# EAGLE design ConverterBoardRev2 (3) (EAGLE 8.4.0)
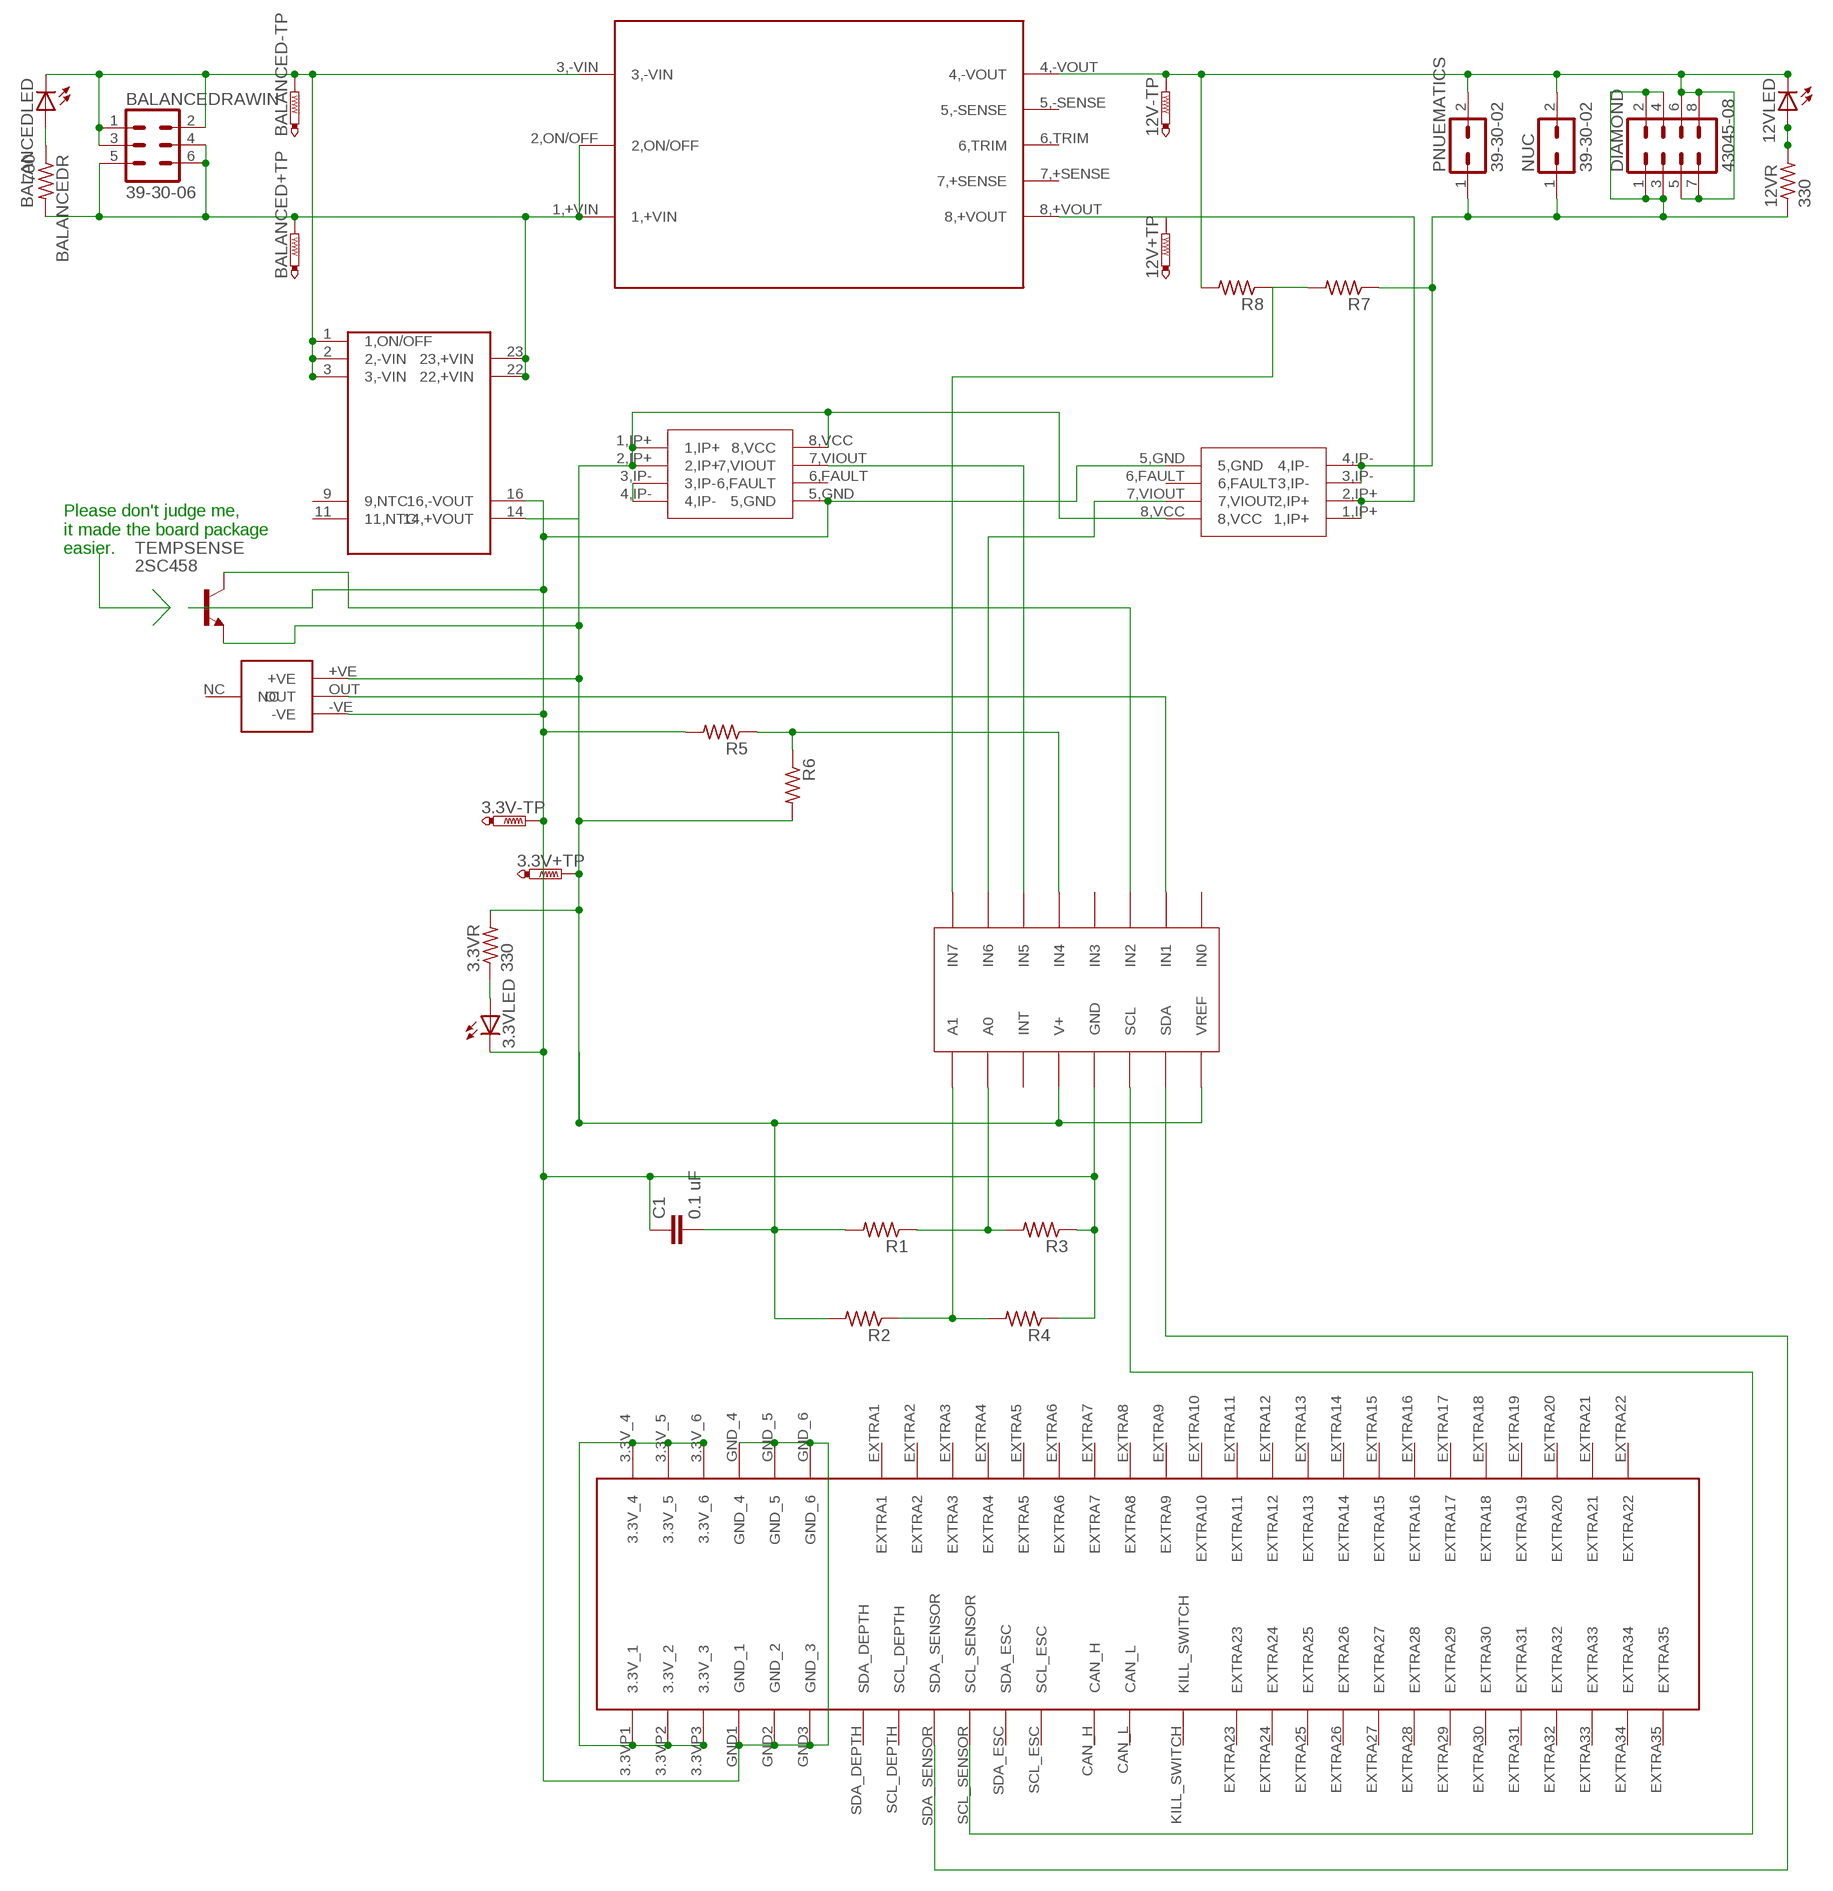
[diagram p0: schematic, sheet 1]

## Parts
3.3V+TP  PTR1B1,27  [B1,27]
3.3V-TP  PTR1B1,27  [B1,27]
3.3VLED  LTST-S270GKT  [LTST-S270GKT]
3.3VR  330  R-US_0204/7  [0204/7]
3V3CUR  CURRENTSENS  [CURRENTSENS]
12V+TP  PTR1B1,27  [B1,27]
12V-TP  PTR1B1,27  [B1,27]
12VCUR  CURRENTSENS  [CURRENTSENS]
12VLED  LTST-S270GKT  [LTST-S270GKT]
12VR  330  R-US_0204/7  [0204/7]
BALANCED+TP  PTR1B1,27  [B1,27]
BALANCED-TP  PTR1B1,27  [B1,27]
BALANCEDLED  LTST-S270GKT  [LTST-S270GKT]
BALANCEDR  700  R-US_0204/7  [0204/7]
BALANCEDRAWIN  39-30-06  [39-30-?06?]
C1  0.1 uF  C-EU025-024X044  [C025-024X044]
DIAMOND  43045-08  [43045-08]
NUC  39-30-02  [39-30-?02?]
PNUEMATICS  39-30-02  [39-30-?02?]
R1  R-US_0204/7  [0204/7]
R2  R-US_0204/7  [0204/7]
R3  R-US_0204/7  [0204/7]
R4  R-US_0204/7  [0204/7]
R5  R-US_0204/7  [0204/7]
R6  R-US_0204/7  [0204/7]
R7  R-US_0204/7  [0204/7]
R8  R-US_0204/7  [0204/7]
TEMPSENSE  2SC458  [TO92-ECB]
U$1  12VCONV  [12VCONV]
U$2  3.3VCONV  [3.3VCONV]
U$3  5530843  [5530843-6-BOARDFINGERS]
U$6  HUMIDITYSENSOR  [HUMIDITYSENSOR]
U$8  ADC128D818  [TSSOP-16]

## Nets
3.3IDATA: 3V3CUR.7,VIOUT U$8.IN5
3.3V+: 3.3V+TP.TP 3.3VR.2 3V3CUR.1,IP+ 3V3CUR.2,IP+ 3V3CUR.8,VCC 12VCUR.8,VCC C1.2 R1.2 R2.2 R6.2 TEMPSENSE.E U$2.14(14,+VOUT) U$6.+VE U$8.V+ U$8.VREF
3.3V-: 3.3V-TP.TP 3.3VLED.CATHODE(C) 3V3CUR.5,GND 12VCUR.5,GND C1.1 R3.1 R4.1 R5.2 TEMPSENSE.B U$2.16(16,-VOUT) U$3.GND1(GND_1) U$3.GND2(GND_2) U$3.GND3(GND_3) U$3.GND_4 U$3.GND_5 U$3.GND_6 U$6.-VE U$8.GND
3.3VBKPLN: 3V3CUR.3,IP- 3V3CUR.4,IP- U$3.3.3V_4 U$3.3.3V_5 U$3.3.3V_6 U$3.3.3VP1(3.3V_1) U$3.3.3VP2(3.3V_2) U$3.3.3VP3(3.3V_3)
3.3VDATA: R5.1 R6.1 U$8.IN4
3.3VLED: 3.3VLED.ANODE(A) 3.3VR.1
12IDATA: 12VCUR.7,VIOUT U$8.IN6
12VDATA: R7.2 R8.1 U$8.IN7
12VGND: 12V-TP.TP 12VLED.CATHODE(C) DIAMOND.5 DIAMOND.6 DIAMOND.7 DIAMOND.8 NUC.2 PNUEMATICS.2 R8.2 U$1.4,-VOUT
12VLED: 12VLED.ANODE(A) 12VR.2
12VMON: 12VCUR.3,IP- 12VCUR.4,IP- 12VR.1 DIAMOND.1 DIAMOND.2 DIAMOND.3 DIAMOND.4 NUC.1 PNUEMATICS.1 R7.1
12VUNMON: 12VCUR.1,IP+ 12VCUR.2,IP+ U$1.8,+VOUT
A0: R1.1 R3.2 U$8.A0
A1: R2.1 R4.2 U$8.A1
BALANCED+: BALANCED+TP.TP BALANCEDR.2 BALANCEDRAWIN.4 BALANCEDRAWIN.5 BALANCEDRAWIN.6 U$1.1,+VIN U$1.2,ON/OFF U$2.22(22,+VIN) U$2.23(23,+VIN)
BALANCED-: BALANCED-TP.TP BALANCEDLED.CATHODE(C) BALANCEDRAWIN.1 BALANCEDRAWIN.2 BALANCEDRAWIN.3 U$1.3,-VIN U$2.1(1,ON/OFF) U$2.2(2,-VIN) U$2.3(3,-VIN)
BALANCEDLED: BALANCEDLED.ANODE(A) BALANCEDR.1
HUMIDITYDATA: U$6.OUT U$8.IN1
SCL: U$3.SCL_SENSOR U$8.SCL
SDA: U$3.SDA_SENSOR U$8.SDA
TEMPDATA: TEMPSENSE.C U$8.IN2
Unconnected: 3V3CUR.6,FAULT 12V+TP.TP 12VCUR.6,FAULT U$1.5,-SENSE U$1.6,TRIM U$1.7,+SENSE U$2.9(9,NTC) U$2.11(11,NTC) U$3.CAN_H U$3.CAN_L U$3.EXTRA1 U$3.EXTRA2 U$3.EXTRA3 U$3.EXTRA4 U$3.EXTRA5 U$3.EXTRA6 U$3.EXTRA7 U$3.EXTRA8 U$3.EXTRA9 U$3.EXTRA10 U$3.EXTRA11 U$3.EXTRA12 U$3.EXTRA13 U$3.EXTRA14 U$3.EXTRA15 U$3.EXTRA16 U$3.EXTRA17 U$3.EXTRA18 U$3.EXTRA19 U$3.EXTRA20 U$3.EXTRA21 U$3.EXTRA22 U$3.EXTRA23 U$3.EXTRA24 U$3.EXTRA25 U$3.EXTRA26 U$3.EXTRA27 U$3.EXTRA28 U$3.EXTRA29 U$3.EXTRA30 U$3.EXTRA31 U$3.EXTRA32 U$3.EXTRA33 U$3.EXTRA34 U$3.EXTRA35 U$3.KILL_SWITCH U$3.SCL_DEPTH U$3.SCL_ESC U$3.SDA_DEPTH U$3.SDA_ESC U$6.NC U$8.IN0 U$8.IN3 U$8.INT

## Notes on the sheet
- Please don't judge me,
  it made the board package
  easier.

## Library data of the parts
3.3V+TP 3.3V-TP 12V+TP 12V-TP BALANCED+TP BALANCED-TP = testpad:PTR1: TEST PIN
3.3VLED 12VLED BALANCEDLED = LTST-S270GKT:LTST-S270GKT
3.3VR 12VR BALANCEDR R1-R8 = resistor:R-US_: RESISTOR, American symbol
3V3CUR 12VCUR = CurrentSensor:CURRENTSENS
BALANCEDRAWIN = con-molex-mini-fit:39-30-?06?: HEADER
C1 = resistor:C-EU: CAPACITOR, European symbol
DIAMOND = con-molex-micro-fit:43045-08: HEADER
NUC PNUEMATICS = con-molex-mini-fit:39-30-?02?: HEADER
TEMPSENSE = transistor:2SC458: NPN Silicon Epitaxial Planar Transistor Source: SEMTECH ELECTRONICS LTD. ... 2SC458 1.pdf
U$1 = 12VCONV:12VCONV
U$2 = 3.3V Converter:3.3VCONV
U$3 = 5530843-6:5530843
U$6 = HumiditySensor:HUMIDITYSENSOR
U$8 = ADC128D818:ADC128D818

## Board
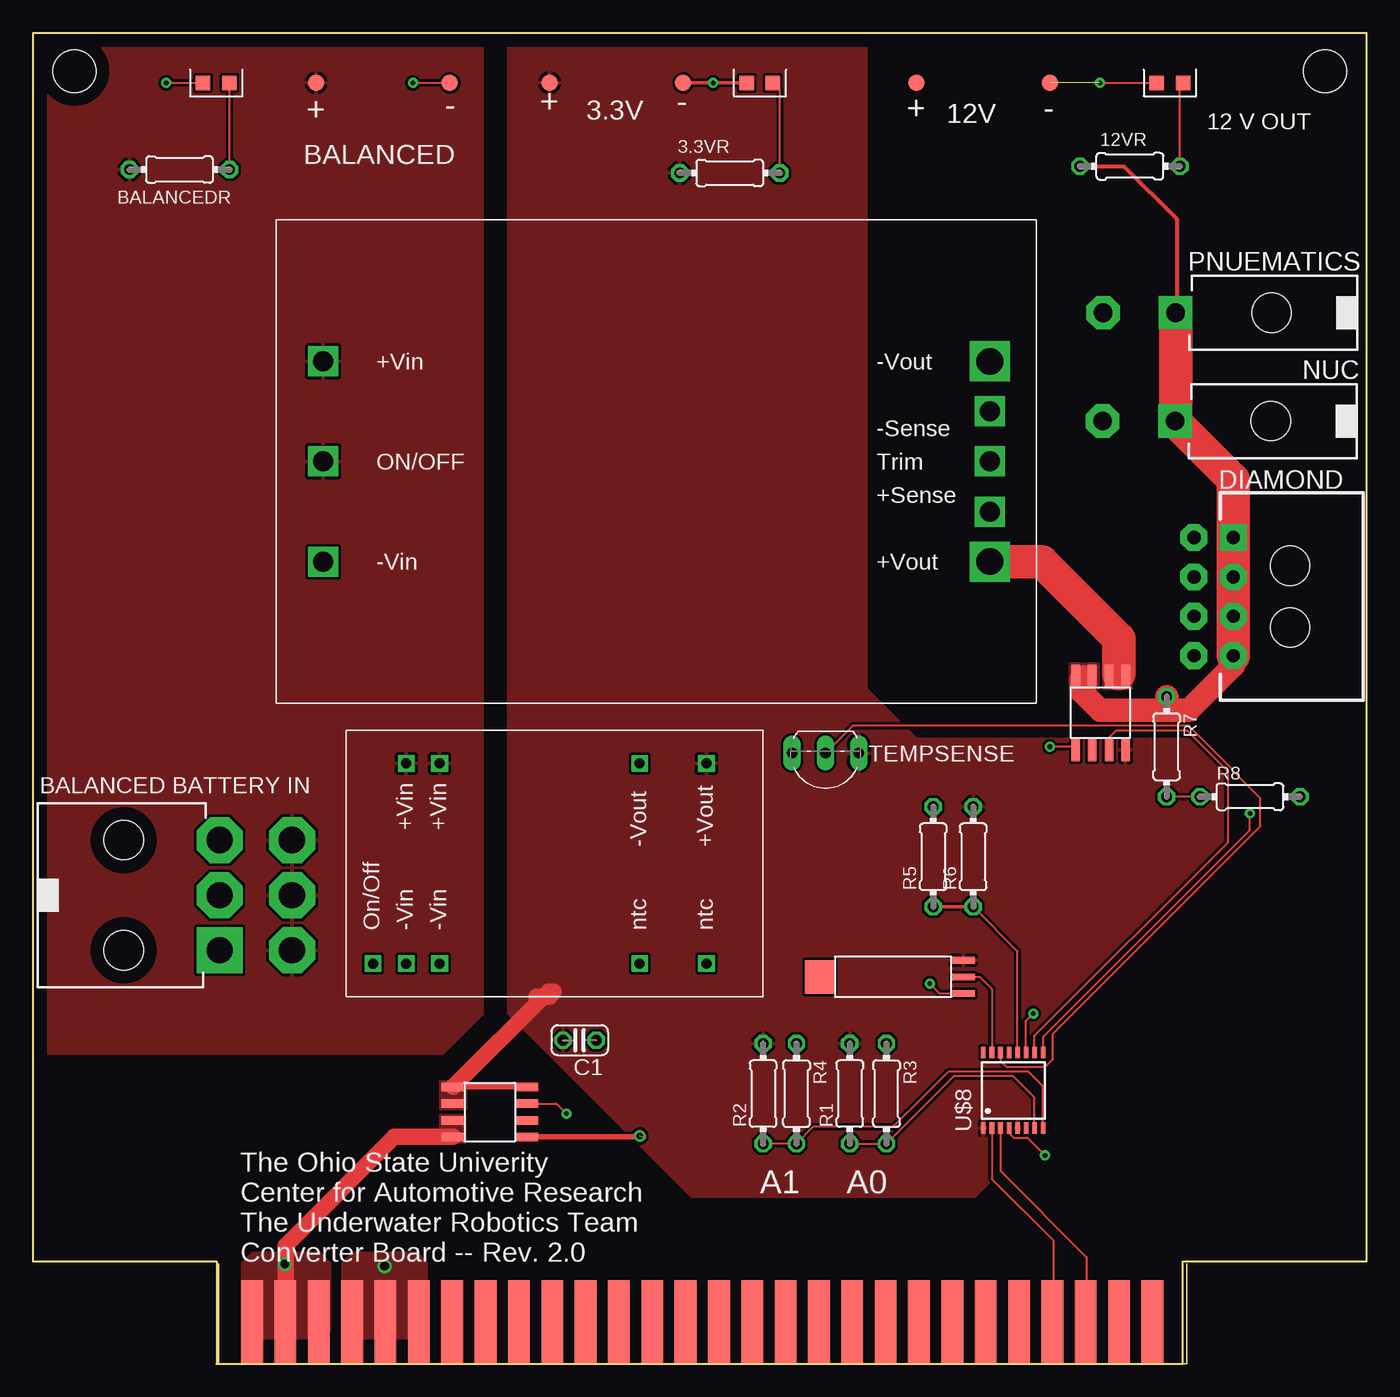
[diagram p1: board, top side]
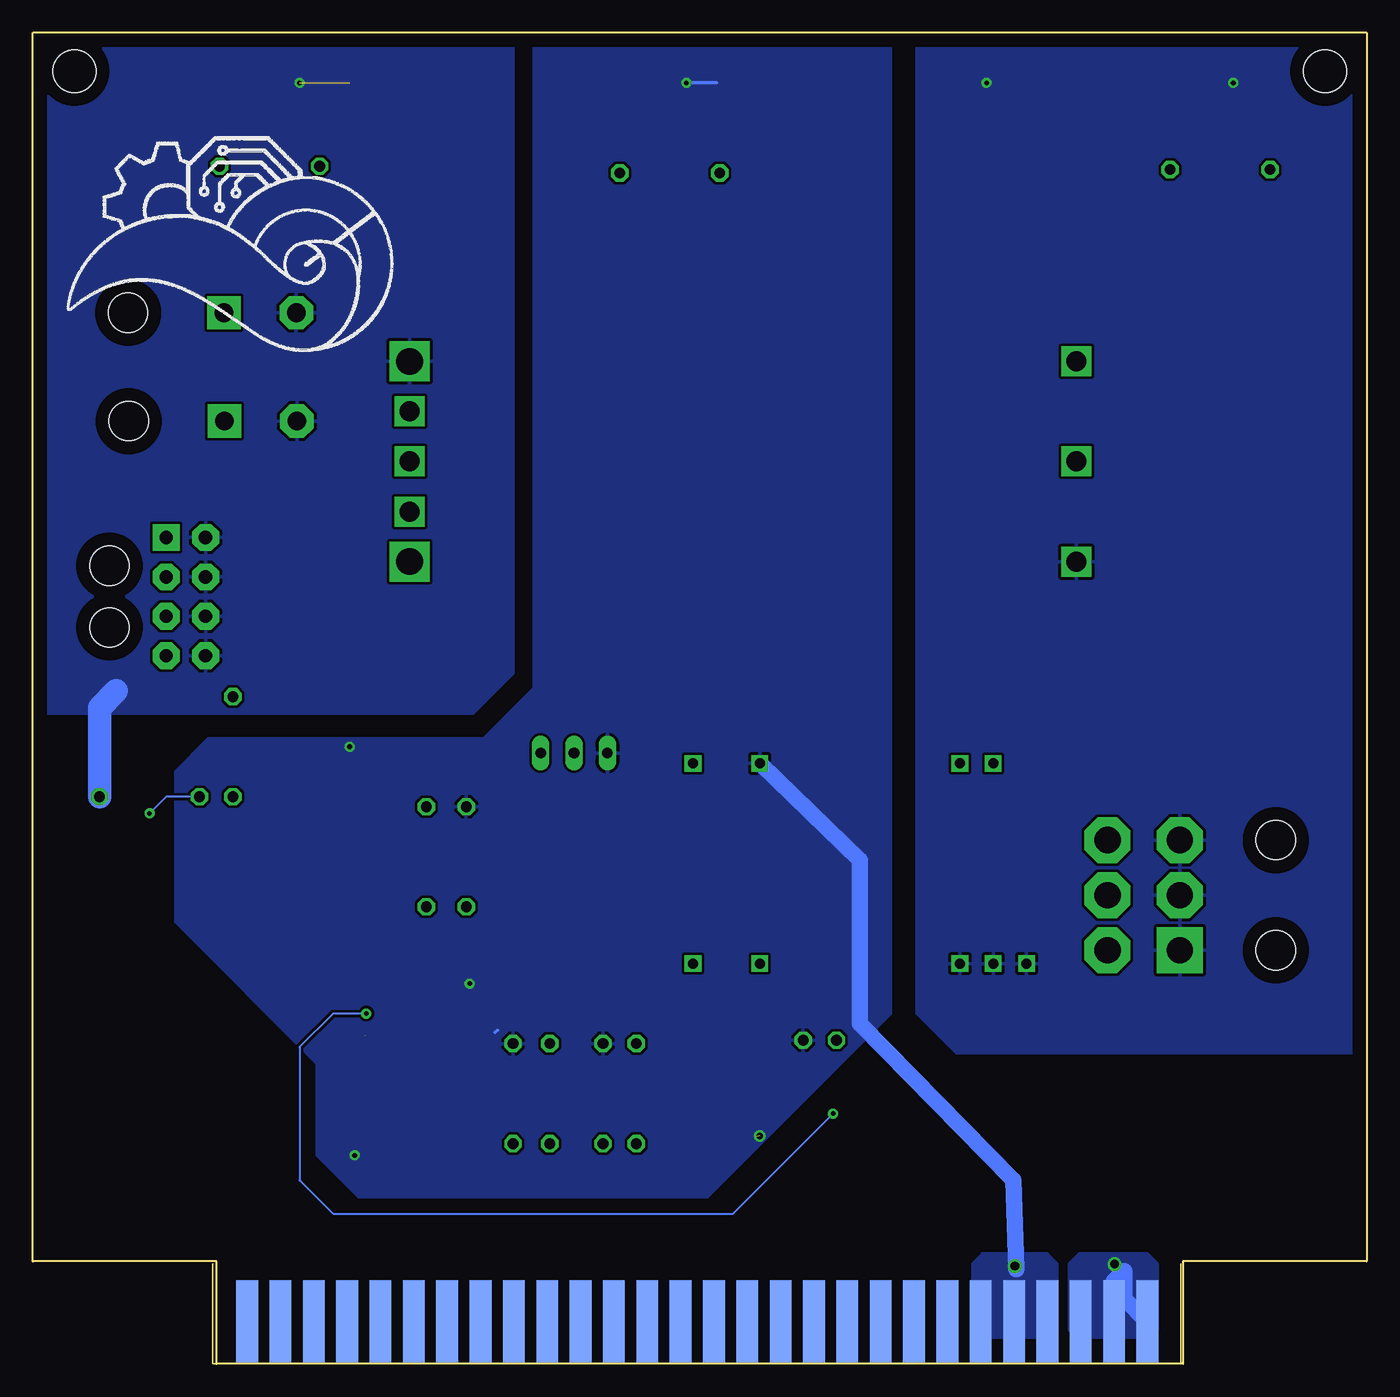
[diagram p2: board, bottom side, seen from below]

Size 101.6 x 101.35 mm. Coordinates in mm from the lower left corner, seen from the top.
Outline: 14,0 87.6,0 87.6,7.8 101.6,7.8 101.6,101.35 0,101.35 0,7.8 14,7.8 14,0
Copper layers (1*16): Top 0.035mm / dielectric 1.5mm / Bottom 0.035mm
Design rules "battery_balancer": minimum track width 6mil, minimum drill 0.35mm, track to track 0.205mm, track to pad 0.205mm, pad to pad 0.205mm, via to via 0.205mm, smd to smd 6mil, copper to edge 40mil, drill to drill 6mil, minimum pad ring 10mil, minimum via ring 8mil, stop-mask expansion 4mil, vias tented up to drill 0mil, thermal gap 10mil
Holes 3.26 mm at 3.17,98.42 98.42,98.42

### Footprints (pad centres in the part's own frame; a part is rotated, then mirrored left to right if it is on the bottom)
B1,27 = smd 1.27 x 1.27: TP 0,0
LTST-S270GKT = smd 1.1 x 1.1: ANODE 1,0; CATHODE -1,0
0204/7 = drill 0.813 octagon: 1 -3.81,0; 2 3.81,0
CURRENTSENS = smd 0.65 x 1.75: 1,IP+ 0,0; 2,IP+ 1.27,0; 3,IP- 2.54,0; 4,IP- 3.81,0; 5,GND 3.81,5.6; 6,FAULT 2.54,5.6; 7,VIOUT 1.27,5.6; 8,VCC 0,5.6
39-30-?06? = drill 2 pad 3.5 square: 1 4.191,0 | drill 2 pad 3.5 octagon: 2 0,0; 3 -4.191,0; 4 4.191,5.512; 5 0,5.512; 6 -4.191,5.512 | hole 3: -4.191,-7.3; 4.191,-7.3
C025-024X044 = drill 0.813 octagon: 1 -1.27,0; 2 1.27,0
43045-08 = drill 1.016 pad 2.032 square: 1 4.5,0 | drill 1.016 pad 2.032 octagon: 2 1.5,0; 3 -1.5,0; 4 -4.5,0; 5 4.5,3; 6 1.5,3; 7 -1.5,3; 8 -4.5,3 | hole 3: -2.35,-4.32; 2.35,-4.32
39-30-?02? = drill 1.422 pad 2.54 square: 1 0,0 | drill 1.422 pad 2.54 octagon: 2 0,5.512 | hole 3: 0,-7.3
TO92-ECB = drill 0.813 long: B 2.54,0; C 0,0; E -2.54,0
12VCONV = drill 1.524 square: 1,+VIN 3.556,26.035; 2,ON/OFF 3.556,18.415; 3,-VIN 3.556,10.795; 5,-SENSE 54.356,22.225; 6,TRIM 54.356,18.415; 7,+SENSE 54.356,14.605 | drill 2.032 square: 4,-VOUT 54.356,26.035; 8,+VOUT 54.356,10.795
3.3VCONV = drill 0.762 square: 1 2.54,29.718; 2 2.54,27.178; 3 2.54,24.638; 9 2.54,9.398; 11 2.54,4.318; 14 17.78,4.318; 16 17.78,9.398; 22 17.78,24.638; 23 17.78,27.178
5530843-6-BOARDFINGERS = smd 1.651 x 6.35 bottom: 3.3V_4 0.826,3.175; 3.3V_5 3.365,3.175; 3.3V_6 5.905,3.175; EXTRA1 16.066,3.175; EXTRA2 18.605,3.175; EXTRA3 21.145,3.175; EXTRA4 23.686,3.175; EXTRA5 26.226,3.175; EXTRA6 28.765,3.175; EXTRA7 31.305,3.175; EXTRA8 33.846,3.175; EXTRA9 36.386,3.175; EXTRA10 38.925,3.175; EXTRA11 41.465,3.175; EXTRA12 44.005,3.175; EXTRA13 46.545,3.175; EXTRA14 49.086,3.175; EXTRA15 51.626,3.175; EXTRA16 54.166,3.175; EXTRA17 56.706,3.175; EXTRA18 59.245,3.175; EXTRA19 61.785,3.175; EXTRA20 64.326,3.175; EXTRA21 66.865,3.175; EXTRA22 69.406,3.175; GND_4 8.445,3.175; GND_5 10.986,3.175; GND_6 13.525,3.175 | smd 1.651 x 6.35: 3.3VP1 0.826,3.175; 3.3VP2 3.365,3.175; 3.3VP3 5.905,3.175; CAN_H 51.626,3.175; CAN_L 54.166,3.175; EXTRA23 16.066,3.175; EXTRA24 18.605,3.175; EXTRA25 21.145,3.175; EXTRA26 23.686,3.175; EXTRA27 26.226,3.175; EXTRA28 28.765,3.175; EXTRA29 31.305,3.175; EXTRA30 33.846,3.175; EXTRA31 36.386,3.175; EXTRA32 38.925,3.175; EXTRA33 41.465,3.175; EXTRA34 44.005,3.175; EXTRA35 46.545,3.175; GND1 8.445,3.175; GND2 10.986,3.175; GND3 13.525,3.175; KILL_SWITCH 49.086,3.175; SCL_DEPTH 59.245,3.175; SCL_ESC 69.406,3.175; SCL_SENSOR 64.326,3.175; SDA_DEPTH 56.706,3.175; SDA_ESC 66.865,3.175; SDA_SENSOR 61.785,3.175
HUMIDITYSENSOR = smd 0.51 x 1.78: +VE 2.54,0; -VE 0,0; OUT 1.27,0 | smd 2.54 x 2.29: NC 1.27,10.925
TSSOP-16 = smd 0.9 x 0.35: A0 -2.875,-1.625; A1 -2.875,-2.275; GND -2.875,0.325; IN0 2.875,2.275; IN1 2.875,1.625; IN2 2.875,0.975; IN3 2.875,0.325; IN4 2.875,-0.325; IN5 2.875,-0.975; IN6 2.875,-1.625; IN7 2.875,-2.275; INT -2.875,-0.975; SCL -2.875,0.975; SDA -2.875,1.625; V+ -2.875,-0.325; VREF -2.875,2.275

### Placement (x,y rotation side)
3.3V+TP  39.37,97.54 0 top
3.3V-TP  49.53,97.54 0 top
3.3VLED  55.37,97.54 0 top
3.3VR  53.09,90.68 180 top
3V3CUR  32,21.08 270 top
12V+TP  67.31,97.54 0 top
12V-TP  77.47,97.54 0 top
12VCUR  83.24,52.35 180 top
12VLED  86.61,97.54 0 top
12VR  83.57,91.19 0 top
BALANCED+TP  21.59,97.54 0 top
BALANCED-TP  31.75,97.54 0 top
BALANCEDLED  13.97,97.54 0 top
BALANCEDR  11.18,90.93 180 top
BALANCEDRAWIN  39-30-06?  [39-30-?06?]  14.22,35.69 270 top
C1  41.66,24.64 180 top
DIAMOND  91.44,58.42 90 top
NUC  39-30-02?  [39-30-?02?]  87,71.78 90 top
PNUEMATICS  39-30-02?  [39-30-?02?]  87.05,80.04 90 top
R1  62.23,20.57 90 top
R2  55.63,20.57 90 top
R3  65.02,20.57 270 top
R4  58.17,20.57 270 top
R5  68.58,38.61 90 top
R6  71.63,38.61 90 top
R7  86.36,46.99 270 top
R8  92.71,43.18 0 top
TEMPSENSE  60.38,46.51 180 top
U$1  18.54,50.29 0 top
U$2  55.63,27.94 90 top
U$3  15.88,0 0 top
U$6  70.87,28.19 90 top
U$8  74.68,20.83 90 top

### Tracks (layer width: path | path; a pad name or v marks a point on that pad's centre or on a via)
3.3IDATA  (via drill 0.35)
  Top 0.152: U$8.IN5 75.65,26.12 v76.2,26.67 | 3V3CUR.7,VIOUT 39.88,19.81 v40.64,19.05
  Bottom 0.152: v76.2,26.67 78.74,26.67 81.28,24.13 81.28,13.97 78.74,11.43 48.26,11.43 v40.64,19.05
3.3V+
  Top 0.406: 3V3CUR.8,VCC 3V3CUR.1,IP+
  Top 1.27: 38.35,27.94 39.37,27.94 | 3V3CUR.1,IP+ 39.27,28.35 39.67,28.35
  pour Top (no thermals): 31.01,21.54 32.99,21.54 32.99,19.35 31.01,19.35
  pour Top: 36.2,26.67 36.2,101.6 63.5,101.6 63.5,51.44 67.31,47.62 70.48,47.62 88.27,47.62 90.81,45.09 90.81,39.37 76.2,24.77 76.2,17.14 71.75,12.7 50.16,12.7
3.3V-  (via drill 0.35, 0.5, 0.65)  (1 unrouted)
  Top 0.152: 70.61,28.19 U$6.-VE 69.09,28.19 v68.33,28.96 | 12VCUR.5,GND 79.19,46.99 v77.47,46.99 | U$8.GND 74.35,17.58 74.71,17.22 75.74,17.22 v77.09,15.88
  Top 0.254: 3.3V-TP.TP v51.82,97.54 3.3VLED.CATHODE
  Top 0.406: 46.51,17.27 46.53,17.25 | 3V3CUR.5,GND 46.15,17.27 v46.23,17.35
  Bottom 0.254: v51.82,97.54 3.3V-TP.TP | 66.22,25.4 66.38,25.23
  Bottom 1.27: U$2.16 38.61,38.35 38.61,25.91 26.92,13.97 26.67,7.19
  other vias: 26.8,7.44
  pour Top (no thermals): 23.62,2.79 23.62,2.54 24.13,2.03 29.46,2.03 29.97,2.54 29.97,7.62 29.21,8.38 24.38,8.38 23.62,7.62
  pour Bottom: 23.62,2.54 24.13,2.03 29.46,2.03 29.97,2.54 29.97,7.62 29.21,8.38 24.64,8.38 24.38,8.38 23.62,7.62
  pour Bottom (no thermals): 24.38,8.38 23.62,7.62 23.62,2.54 24.13,2.03 28.96,2.03 29.21,2.03 29.97,2.79 29.97,7.62 29.21,8.38
  pour Bottom: 36.2,26.67 36.2,100.97 63.5,100.97 63.5,98.42 63.5,51.44 67.31,47.62 88.27,47.62 90.81,45.09 90.81,40.01 90.81,33.66 80.01,22.86 80.01,15.88 76.83,12.7 50.16,12.7
3.3VBKPLN  (via drill 0.65)
  Top 1.27: U$3.3.3VP2 19.24,8.83 | 19.24,7.49 19.24,9 27.51,17.27 3V3CUR.4,IP-
  Bottom 1.27: U$3.3.3VP1 18.47,4.94 18.47,7.06 19.24,6.29 U$3.3.3VP2
  other vias: 19.2,7.59
  pour Top (no thermals): 31.01,18.97 32.97,18.97 32.97,16.84 31.01,16.84
  pour Top (no thermals): 16.76,8.38 16,7.62 16,2.54 16.51,2.03 21.59,2.03 22.1,2.03 22.61,2.54 22.61,7.62 21.84,8.38 17.02,8.38
  pour Bottom (no thermals): 16,7.37 16,2.54 16.51,2.03 22.1,2.03 22.61,2.54 22.61,7.62 21.84,8.38 16.76,8.38 16,7.62
3.3VDATA
  Top 0.152: U$8.IN4 75,31.43 R6.1
  Top 0.254: R6.1 R5.1
3.3VLED
  Top 0.152: 3.3VR.1 56.9,97.01 3.3VLED.ANODE
12IDATA  (1 unrouted)
  Top 0.152: U$8.IN6 76.3,24.99 | 91.01,39.67 76.3,24.97 | 91.01,39.67 91.03,39.7 | 91.01,39.67 91.01,45.14 87.91,48.23 82.53,48.23 81.97,47.68 12VCUR.7,VIOUT
12VDATA  (via drill 0.35)
  Top 0.152: U$8.IN7 76.96,23.71 76.96,24.89 92.71,40.64 v92.71,41.91 | R8.1 R7.2
  Bottom 0.152: R8.1 91.44,43.18 v92.71,41.91
12VGND  (via drill 0.35)  (1 unrouted)
  Top 0.152: v81.28,97.54 12VLED.CATHODE
  Bottom 1.778: R8.2 96.52,49.96 95.25,51.23
  pour Bottom: 65.02,101.6 65.02,52.58 68.07,49.53 101.6,49.53 101.6,101.6
12VLED
  Top 0.152: 12VR.2 87.38,97.3 12VLED.ANODE
12VMON
  Top 0.305: 12VR.1 83.11,91.19 87.12,87.17 87.12,80.11 PNUEMATICS.1
  Top 1.778: DIAMOND.4 91.44,53.16 88.04,49.76 86.36,49.76 | 86.36,49.76 81.3,49.76 79.86,51.21 79.86,52.12 80.03,52.3 | R7.1 86.36,49.76
  Top 2.54: PNUEMATICS.1 87.05,71.83 NUC.1 91.44,67.33 DIAMOND.1 DIAMOND.2 DIAMOND.3 DIAMOND.4
  pour Top (no thermals): 78.99,53.34 81.15,53.34 81.15,51.36 78.99,51.36
12VUNMON
  Top 2.54: U$1.8,+VOUT 76.86,61.09 82.73,55.22 82.73,52.53
  pour Top (no thermals): 81.53,53.34 83.69,53.34 83.69,51.36 81.53,51.36
A0
  Top 0.152: R1.1 R3.2 70.15,21.89 74.7,21.89 76.3,20.29 U$8.A0
A1
  Top 0.152: R2.1 R4.2 59.44,18.03 65.53,18.03 67.92,20.42 | U$8.A1 76.95,19.04 | 76.95,19.04 76.96,19.05 | 67.92,20.42 | 76.95,19.04 76.95,21.12 75.82,22.25 69.75,22.25 67.92,20.42
BALANCED+
  pour Top: 0,101.6 0,23.88 0.25,23.62 31.24,23.62 34.29,26.67 34.29,101.6
BALANCED-  (via drill 0.35)
  Top 0.152: v10.16,97.54 BALANCEDLED.CATHODE | v28.96,97.54 BALANCED-TP.TP
  pour Bottom: 0,101.6 0,23.62 31.24,23.62 34.29,26.67 34.29,101.6
BALANCEDLED
  Top 0.152: BALANCEDR.1 14.99,97.52 BALANCEDLED.ANODE
HUMIDITYDATA
  Top 0.152: U$6.OUT 72.14,29.46 73.05,28.55 U$8.IN1
SCL
  Top 0.152: U$8.SCL 73.7,14.69 80.26,8.13 80.26,3.24 U$3.SCL_SENSOR
SDA
  Top 0.152: U$8.SDA 73.05,14.07 77.72,9.4 77.72,3.24 U$3.SDA_SENSOR
TEMPDATA
  Top 0.152: U$8.IN2 73.7,23.07 74.17,22.61 77.11,22.61 77.7,23.19 77.7,25.12 93.5,40.92 93.5,43.05 91.37,45.19 91.37,45.28 88.06,48.59 62.46,48.59 TEMPSENSE.C

### Text on the board
tPlace: + | - | + | 3.3V | - | + | - | 12V | 12 V OUT | BALANCED | BALANCED BATTERY IN
tNames: A1 | A0 | The Ohio State Univerity / Center for Automotive Research / The Underwater Robotics Team / Converter Board -- Rev. 2.0